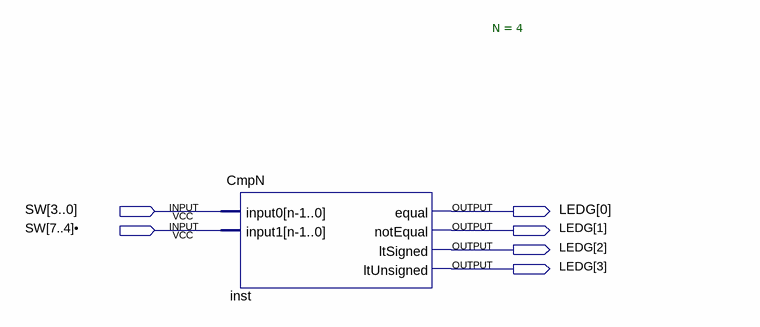
[diagram p0: schematic sheet]
// Quartus schematic CmpN_Demo.bdf as structural Verilog: 1 symbols, 6 pins
module CmpN_Demo (
  input  [3:0] SW,
  input  \SW[7..4]• ,
  output [3:0] LEDG
);

  CmpN #(.N(4)) inst (
    .input0(SW), .input1({4{\SW[7..4]• }}), .equal(LEDG[0]), .notEqual(LEDG[1]), .ltSigned(LEDG[2]),
    .ltUnsigned(LEDG[3]));
endmodule
